# Altium schematic sheet FMC_HPC_UFL_DEBUG_HPC_AB.SchDoc: HPC connector ROW A and ROW B
size A4; Date: 13.12.2024; ApprovedBy: PFH; CompanyName: IAM Electronic GmbH; DrawnBy: PFH; Engineer: PFH; DocumentNumber: 5; Revision: A; SheetNumber: 5; SheetTotal: 9; Projekt: FMC HPC-U.FL Debug Board; Website: www.fmchub.com
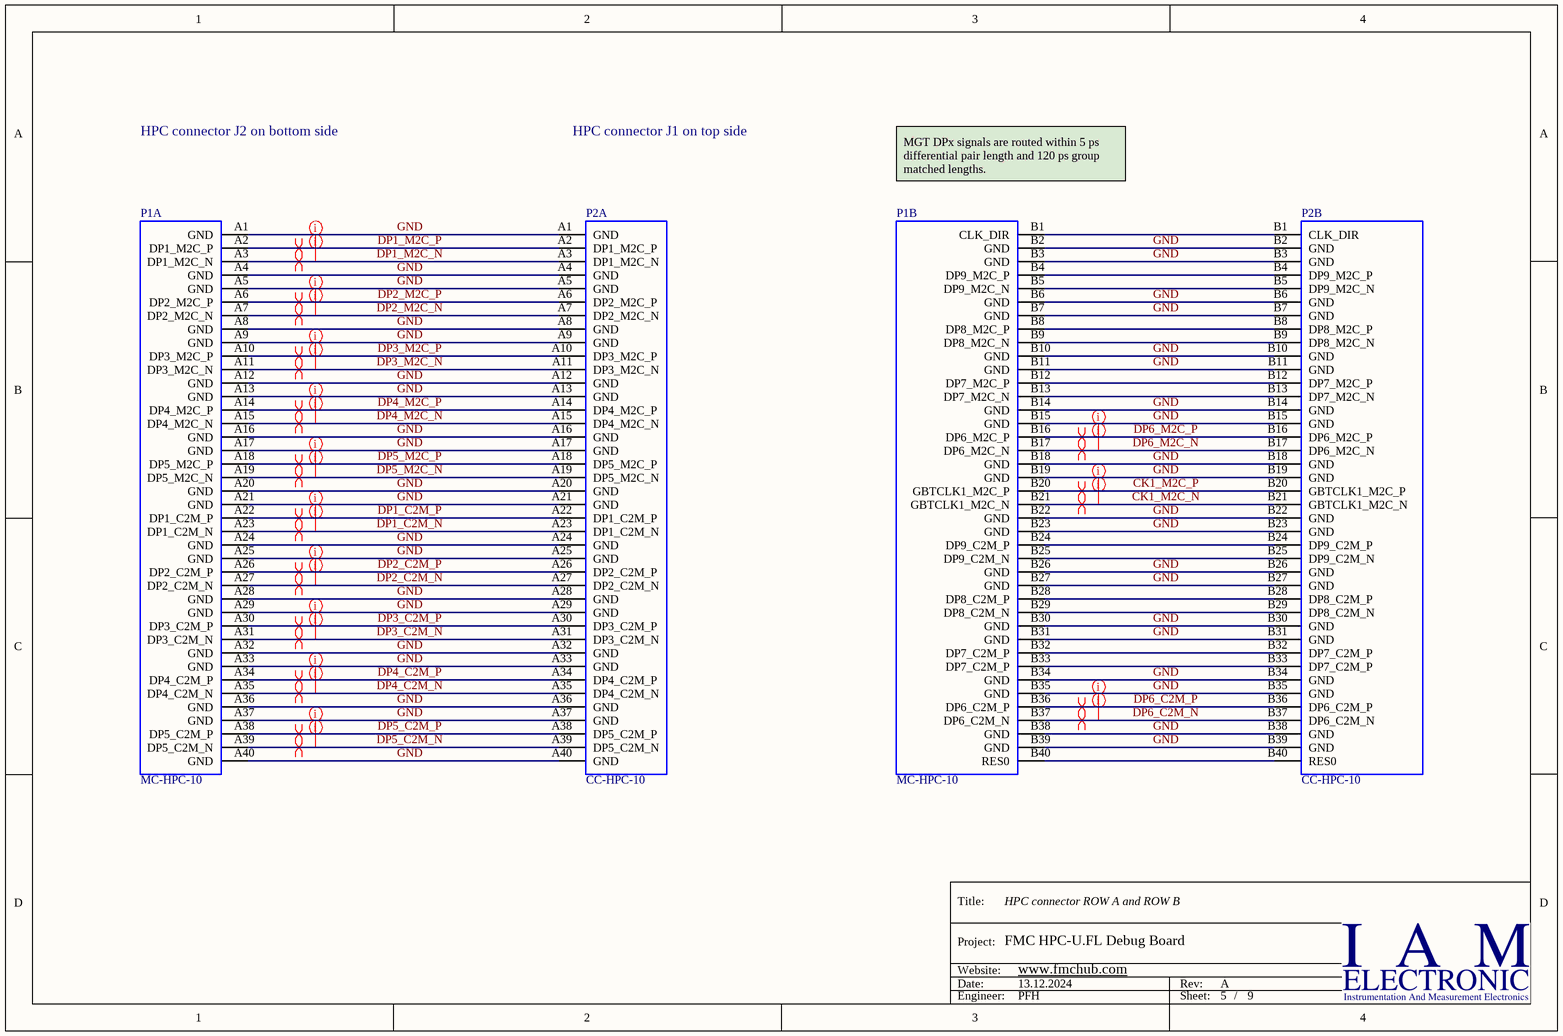
[diagram p0: FMC_HPC_UFL_DEBUG_HPC_AB.SchDoc]

## Parts
P1  MC-HPC-10  [ASP-134488-01]  (parts A,B of 10)
P2  CC-HPC-10  [ASP-134486-01]  (parts A,B of 10)

## Nets
CK1_M2C_N: P1.B21(GBTCLK1_M2C_N) P2.B21(GBTCLK1_M2C_N)
CK1_M2C_P: P1.B20(GBTCLK1_M2C_P) P2.B20(GBTCLK1_M2C_P)
DP1_C2M_N: P1.A23(DP1_C2M_N) P2.A23(DP1_C2M_N)
DP1_C2M_P: P1.A22(DP1_C2M_P) P2.A22(DP1_C2M_P)
DP1_M2C_N: P1.A3(DP1_M2C_N) P2.A3(DP1_M2C_N)
DP1_M2C_P: P1.A2(DP1_M2C_P) P2.A2(DP1_M2C_P)
DP2_C2M_N: P1.A27(DP2_C2M_N) P2.A27(DP2_C2M_N)
DP2_C2M_P: P1.A26(DP2_C2M_P) P2.A26(DP2_C2M_P)
DP2_M2C_N: P1.A7(DP2_M2C_N) P2.A7(DP2_M2C_N)
DP2_M2C_P: P1.A6(DP2_M2C_P) P2.A6(DP2_M2C_P)
DP3_C2M_N: P1.A31(DP3_C2M_N) P2.A31(DP3_C2M_N)
DP3_C2M_P: P1.A30(DP3_C2M_P) P2.A30(DP3_C2M_P)
DP3_M2C_N: P1.A11(DP3_M2C_N) P2.A11(DP3_M2C_N)
DP3_M2C_P: P1.A10(DP3_M2C_P) P2.A10(DP3_M2C_P)
DP4_C2M_N: P1.A35(DP4_C2M_N) P2.A35(DP4_C2M_N)
DP4_C2M_P: P1.A34(DP4_C2M_P) P2.A34(DP4_C2M_P)
DP4_M2C_N: P1.A15(DP4_M2C_N) P2.A15(DP4_M2C_N)
DP4_M2C_P: P1.A14(DP4_M2C_P) P2.A14(DP4_M2C_P)
DP5_C2M_N: P1.A39(DP5_C2M_N) P2.A39(DP5_C2M_N)
DP5_C2M_P: P1.A38(DP5_C2M_P) P2.A38(DP5_C2M_P)
DP5_M2C_N: P1.A19(DP5_M2C_N) P2.A19(DP5_M2C_N)
DP5_M2C_P: P1.A18(DP5_M2C_P) P2.A18(DP5_M2C_P)
DP6_C2M_N: P1.B37(DP6_C2M_N) P2.B37(DP6_C2M_N)
DP6_C2M_P: P1.B36(DP6_C2M_P) P2.B36(DP6_C2M_P)
DP6_M2C_N: P1.B17(DP6_M2C_N) P2.B17(DP6_M2C_N)
DP6_M2C_P: P1.B16(DP6_M2C_P) P2.B16(DP6_M2C_P)
GND: P1.A1(GND) P1.A4(GND) P1.A5(GND) P1.A8(GND) P1.A9(GND) P1.A12(GND) P1.A13(GND) P1.A16(GND) P1.A17(GND) P1.A20(GND) P1.A21(GND) P1.A24(GND) P1.A25(GND) P1.A28(GND) P1.A29(GND) P1.A32(GND) P1.A33(GND) P1.A36(GND) P1.A37(GND) P1.A40(GND) P1.B2(GND) P1.B3(GND) P1.B6(GND) P1.B7(GND) P1.B10(GND) P1.B11(GND) P1.B14(GND) P1.B15(GND) P1.B18(GND) P1.B19(GND) P1.B22(GND) P1.B23(GND) P1.B26(GND) P1.B27(GND) P1.B30(GND) P1.B31(GND) P1.B34(GND) P1.B35(GND) P1.B38(GND) P1.B39(GND) P2.A1(GND) P2.A4(GND) P2.A5(GND) P2.A8(GND) P2.A9(GND) P2.A12(GND) P2.A13(GND) P2.A16(GND) P2.A17(GND) P2.A20(GND) P2.A21(GND) P2.A24(GND) P2.A25(GND) P2.A28(GND) P2.A29(GND) P2.A32(GND) P2.A33(GND) P2.A36(GND) P2.A37(GND) P2.A40(GND) P2.B2(GND) P2.B3(GND) P2.B6(GND) P2.B7(GND) P2.B10(GND) P2.B11(GND) P2.B14(GND) P2.B15(GND) P2.B18(GND) P2.B19(GND) P2.B22(GND) P2.B23(GND) P2.B26(GND) P2.B27(GND) P2.B30(GND) P2.B31(GND) P2.B34(GND) P2.B35(GND) P2.B38(GND) P2.B39(GND)
NetP1_B1: P1.B1(CLK_DIR) P2.B1(CLK_DIR)
NetP1_B4: P1.B4(DP9_M2C_P) P2.B4(DP9_M2C_P)
NetP1_B5: P1.B5(DP9_M2C_N) P2.B5(DP9_M2C_N)
NetP1_B8: P1.B8(DP8_M2C_P) P2.B8(DP8_M2C_P)
NetP1_B9: P1.B9(DP8_M2C_N) P2.B9(DP8_M2C_N)
NetP1_B12: P1.B12(DP7_M2C_P) P2.B12(DP7_M2C_P)
NetP1_B13: P1.B13(DP7_M2C_N) P2.B13(DP7_M2C_N)
NetP1_B24: P1.B24(DP9_C2M_P) P2.B24(DP9_C2M_P)
NetP1_B25: P1.B25(DP9_C2M_N) P2.B25(DP9_C2M_N)
NetP1_B28: P1.B28(DP8_C2M_P) P2.B28(DP8_C2M_P)
NetP1_B29: P1.B29(DP8_C2M_N) P2.B29(DP8_C2M_N)
NetP1_B32: P1.B32(DP7_C2M_P) P2.B32(DP7_C2M_P)
NetP1_B33: P1.B33(DP7_C2M_P) P2.B33(DP7_C2M_P)
NetP1_B40: P1.B40(RES0) P2.B40(RES0)

## Layout directives
differential pair: CK1_M2C_N, CK1_M2C_P, DP1_C2M_N, DP1_C2M_P, DP1_M2C_N, DP1_M2C_P, DP2_C2M_N, DP2_C2M_P, DP2_M2C_N, DP2_M2C_P, DP3_C2M_N, DP3_C2M_P, DP3_M2C_N, DP3_M2C_P, DP4_C2M_N, DP4_C2M_P, DP4_M2C_N, DP4_M2C_P, DP5_C2M_N, DP5_C2M_P, DP5_M2C_N, DP5_M2C_P, DP6_C2M_N, DP6_C2M_P, DP6_M2C_N, DP6_M2C_P
net class MGT; rule Differential Pairs Routing [Pref Gap = 6mil    Min Gap  = 6mil    Max Gap  = 6milPref Width = 6mil    Min Width  = 4mil    Max Width  = 6mil]; rule Matched Net Lengths [Delay Tolerance = 120ps]: CK1_M2C_N, CK1_M2C_P, DP1_C2M_N, DP1_C2M_P, DP1_M2C_N, DP1_M2C_P, DP2_C2M_N, DP2_C2M_P, DP2_M2C_N, DP2_M2C_P, DP3_C2M_N, DP3_C2M_P, DP3_M2C_N, DP3_M2C_P, DP4_C2M_N, DP4_C2M_P, DP4_M2C_N, DP4_M2C_P, DP5_C2M_N, DP5_C2M_P, DP5_M2C_N, DP5_M2C_P, DP6_C2M_N, DP6_C2M_P, DP6_M2C_N, DP6_M2C_P

## Notes on the sheet
- HPC connector J2 on bottom side
- HPC connector J1 on top side
- MGT DPx signals are routed within 5 ps differential pair length and 120 ps group matched lengths.
- Title:
- Project:
- Date:
- Website:
- Rev:
- Engineer:
- Sheet:
- /

## Library data of the parts
P1 = MC-HPC-10: MC-HPC-10, FMC High-pin count connector, lead free, 400 I/Os, male, 10 mm mated stack height; Manufacturer: Samtec; Manufacturer Ref: SEAM-40-03.5-S-10-2-A-K-TR-VITA57.0; Pitch: 1.27 mm; Mated Stack Height: 10 mm; Solder Type: Lead-Free; Number I/O: 400; PartName: ASP-134488-01; Part: ASP-134488-01; Vita PartNumber: MC-HPC-10; Pin Count: High; Gender: male; Supplier 1: Digi-Key; Supplier Part Number 1: SAM8730-ND
P2 = CC-HPC-10: CC-HPC-10, FMC High-pin count connector, lead free, 400 I/Os, female, 10 mm mated stack height; Manufacturer: Samtec; Manufacturer Ref: SEAF-40-06.5-10-A; Pitch: 1.27 mm; Mated Stack Height: 10 mm; Solder Type: Lead-Free; Number I/O: 400; PartName: ASP-134486-01; Part: ASP-134486-01; Vita PartNumber: CC-HPC-10; Pin Count: High; Gender: female; Supplier 1: Digi-Key; Supplier Part Number 1: SAM8728-ND